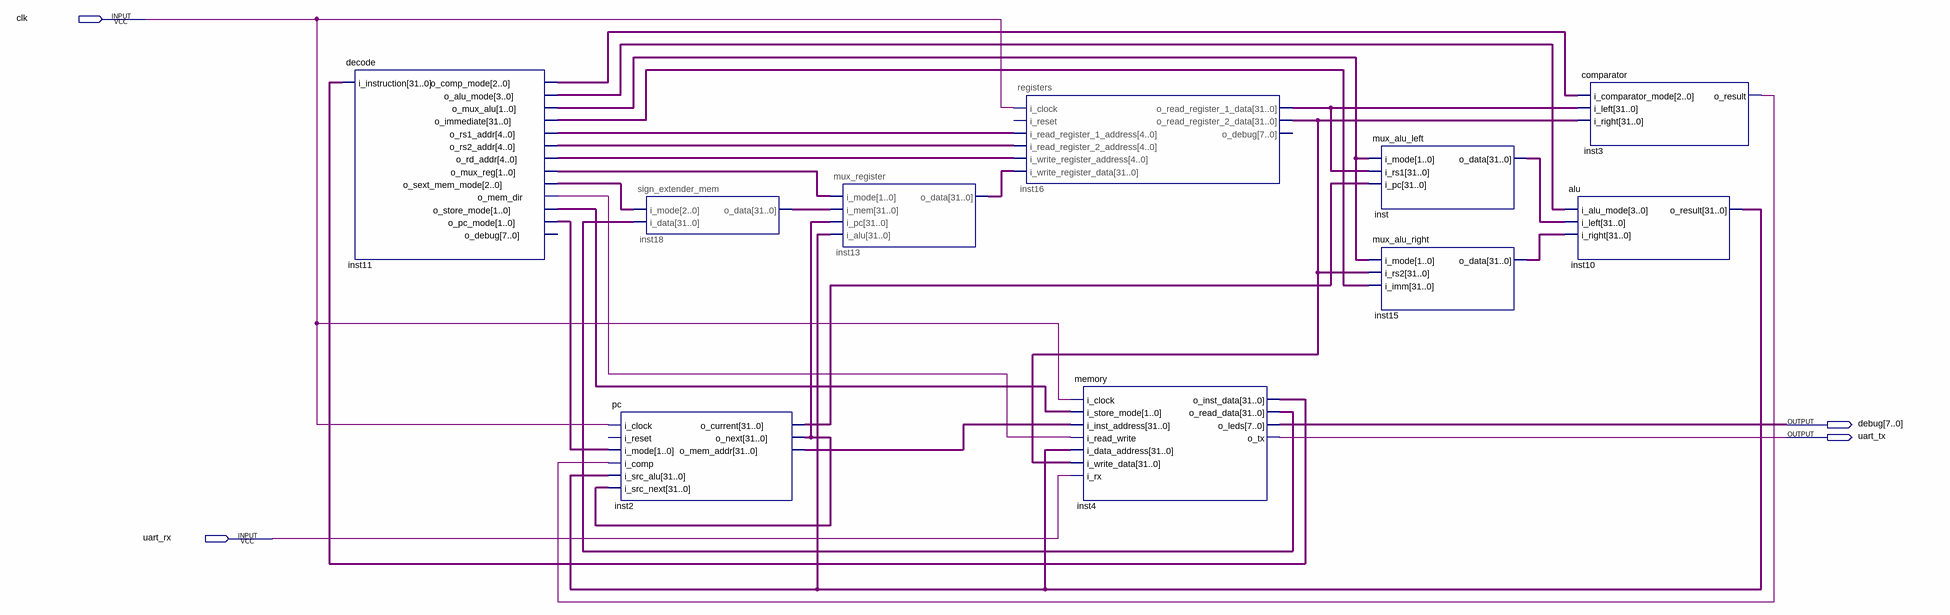
[diagram p0: schematic sheet]
// Quartus schematic Riscv.bdf as structural Verilog: 10 symbols, 4 pins
module Riscv (
  input  clk,
  input  uart_rx,
  output [7:0] debug,
  output uart_tx
);

  wire inst3_o_result, inst11_o_mem_dir;
  wire [1:0] inst11_o_mux_alu, inst11_o_mux_reg, inst11_o_pc_mode, inst11_o_store_mode;
  wire [2:0] inst11_o_comp_mode, inst11_o_sext_mem_mode;
  wire [3:0] inst11_o_alu_mode;
  wire [4:0] inst11_o_rd_addr, inst11_o_rs1_addr, inst11_o_rs2_addr;
  wire [31:0] inst2_o_current, inst2_o_mem_addr, inst2_o_next, inst4_o_inst_data, inst4_o_read_data,
       inst10_o_result, inst11_o_immediate, inst13_o_data, inst15_o_data, inst16_o_read_register_1_data,
       inst16_o_read_register_2_data, inst18_o_data, inst_o_data;

  decode inst11 (
    .i_instruction(inst4_o_inst_data), .o_comp_mode(inst11_o_comp_mode), .o_alu_mode(inst11_o_alu_mode),
    .o_mux_alu(inst11_o_mux_alu), .o_immediate(inst11_o_immediate), .o_rs1_addr(inst11_o_rs1_addr),
    .o_rs2_addr(inst11_o_rs2_addr), .o_rd_addr(inst11_o_rd_addr), .o_mux_reg(inst11_o_mux_reg),
    .o_sext_mem_mode(inst11_o_sext_mem_mode), .o_mem_dir(inst11_o_mem_dir),
    .o_store_mode(inst11_o_store_mode), .o_pc_mode(inst11_o_pc_mode));  // open: o_debug
  sign_extender_mem inst18 (.i_mode(inst11_o_sext_mem_mode), .i_data(inst4_o_read_data), .o_data(inst18_o_data));
  pc inst2 (
    .i_clock(clk), .i_mode(inst11_o_pc_mode), .i_comp(inst3_o_result), .i_src_alu(inst10_o_result),
    .i_src_next(inst2_o_next), .o_current(inst2_o_current), .o_next(inst2_o_next),
    .o_mem_addr(inst2_o_mem_addr));  // open: i_reset
  mux_register inst13 (
    .i_mode(inst11_o_mux_reg), .i_mem(inst18_o_data), .i_pc(inst2_o_next), .i_alu(inst10_o_result),
    .o_data(inst13_o_data));
  registers inst16 (
    .i_clock(clk), .i_read_register_1_address(inst11_o_rs1_addr),
    .i_read_register_2_address(inst11_o_rs2_addr), .i_write_register_address(inst11_o_rd_addr),
    .i_write_register_data(inst13_o_data), .o_read_register_1_data(inst16_o_read_register_1_data),
    .o_read_register_2_data(inst16_o_read_register_2_data));  // open: i_reset, o_debug
  memory inst4 (
    .i_clock(clk), .i_store_mode(inst11_o_store_mode), .i_inst_address(inst2_o_mem_addr),
    .i_read_write(inst11_o_mem_dir), .i_data_address(inst10_o_result),
    .i_write_data(inst16_o_read_register_2_data), .i_rx(uart_rx), .o_inst_data(inst4_o_inst_data),
    .o_read_data(inst4_o_read_data), .o_leds(debug), .o_tx(uart_tx));
  mux_alu_left inst (
    .i_mode(inst11_o_mux_alu), .i_rs1(inst16_o_read_register_1_data), .i_pc(inst2_o_current),
    .o_data(inst_o_data));
  mux_alu_right inst15 (
    .i_mode(inst11_o_mux_alu), .i_rs2(inst16_o_read_register_2_data), .i_imm(inst11_o_immediate),
    .o_data(inst15_o_data));
  comparator inst3 (
    .i_comparator_mode(inst11_o_comp_mode), .i_left(inst16_o_read_register_1_data),
    .i_right(inst16_o_read_register_2_data), .o_result(inst3_o_result));
  alu inst10 (
    .i_alu_mode(inst11_o_alu_mode), .i_left(inst_o_data), .i_right(inst15_o_data), .o_result(inst10_o_result));
endmodule
